# EasyEDA schematic SCH_protopanda_v10.json
TITLE: Protopanda; REV: 1.0; Date: 2025-01-20; Sheet: 1/1; Drawn By: mockthebear; Company: WAH
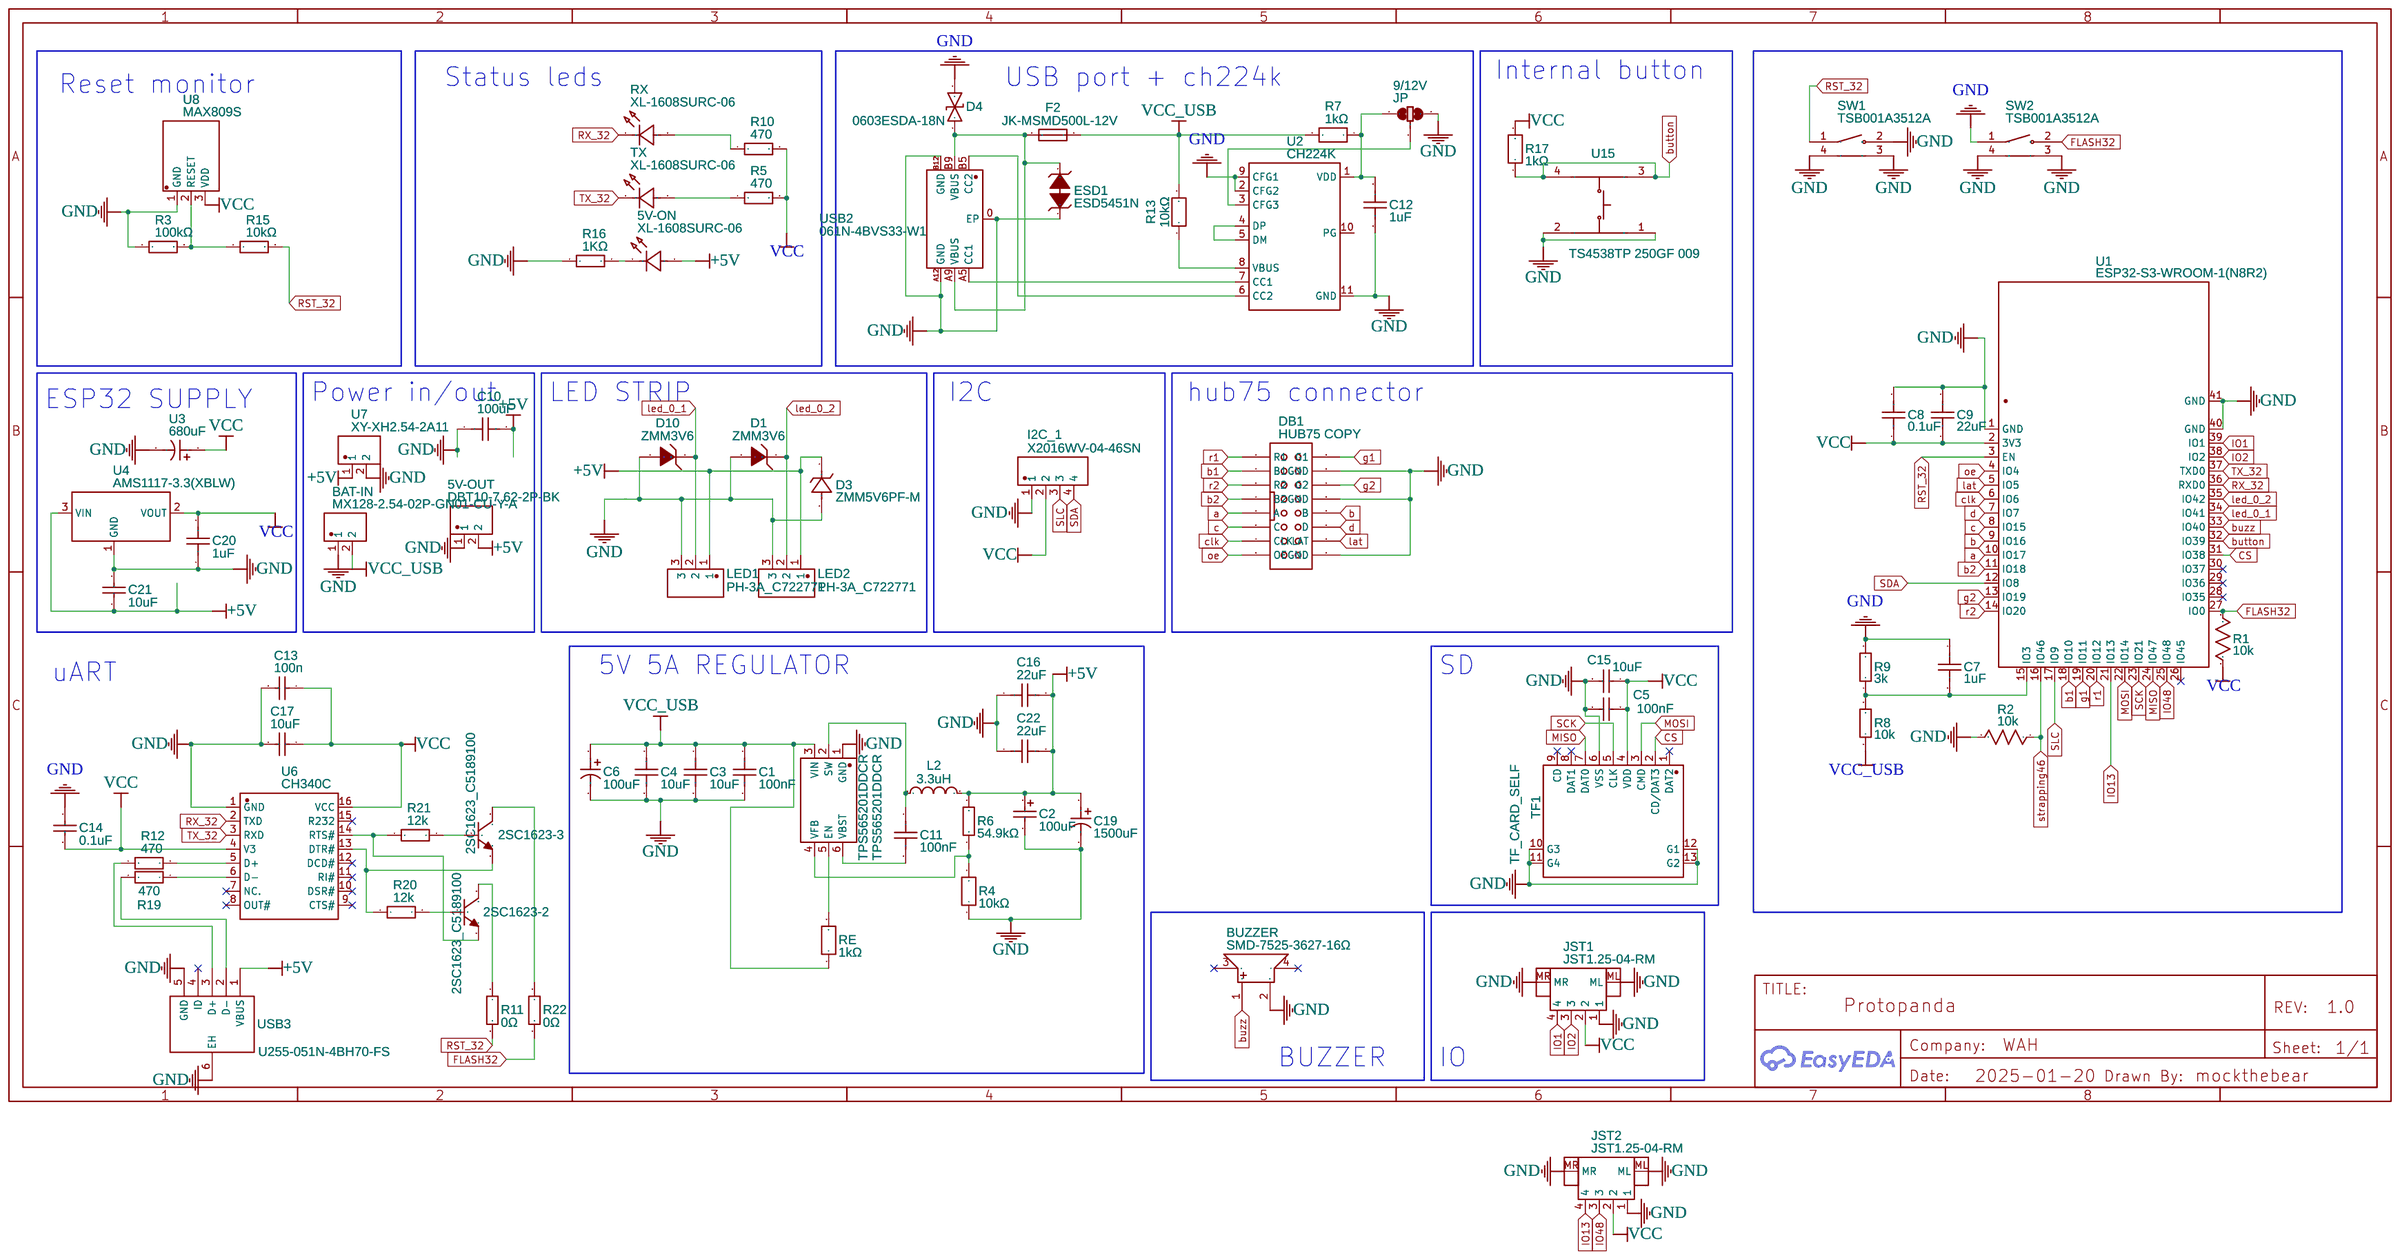
[diagram p0: schematic sheet]

## Parts
2SC1623-2  2SC1623_C5189100  [SOT-23-3_L2.9-W1.3-P1.90-LS2.4-BR]
2SC1623-3  2SC1623_C5189100  [SOT-23-3_L2.9-W1.3-P1.90-LS2.4-BR]
5V-ON  XL-1608SURC-06  [LED0603-RD_RED]
5V-OUT  DBT10-7.62-2P-BK  [CONN-TH_2P-P7.62_DBT10-7.62-2P-BK]
9/12V  JP  [PAD-JUMPER-3-NO_YES_SILK_FULL_BOX]
BAT-IN  MX128-2.54-02P-GN01-CU-Y-A  [CONN-TH_2P-P2.54_MX128-2.54-GN01-02P-CU-Y-A]
BUZZER  SMD-7525-3627-16Ω  [BUZ-SMD_4P-L7.5-W7.5-BR]
C1  100nF  [C0603]
C2  100uF  [CASE-A_3216]
C3  10uF  [C0603]
C4  10uF  [C0603]
C5  100nF  [C0603]
C6  100uF  [CAP-SMD_BD6.3-L6.6-W6.6-LS7.2-FD]
C7  1uF  [C0603]
C8  0.1uF  [C0603]
C9  22uF  [C0603]
C10  100uF  [C1206]
C11  100nF  [C0603]
C12  1uF  [C0603]
C13  100n  [C0603]
C14  0.1uF  [C0603]
C15  10uF  [C0603]
C16  22uF  [C0805]
C17  10uF  [C0603]
C19  1500uF  [CAP-SMD_BD8.0-L8.3-W8.3-LS9.3-FD-1]
C20  1uF  [C0603]
C21  10uF  [C0603]
C22  22uF  [C0805]
D1  ZMM3V6  [LL-34_L3.5-W1.5-RD]
D3  ZMM5V6PF-M  [LL-34_L3.5-W1.5-RD]
D4  0603ESDA-18N  [D0603-BI]
D10  ZMM3V6  [LL-34_L3.5-W1.5-RD]
DB1  HUB75 COPY  [HUB75]
ESD1  ESD5451N  [DFN1006-2L-BI]
F2  JK-MSMD500L-12V  [F1812]
I2C_1  X2016WV-04-46SN  [CONN-TH_X2016WV-04-46SN]
JST1  JST1.25-04-RM  [JST1.25-04-RM]
JST2  JST1.25-04-RM  [JST1.25-04-RM]
L2  3.3uH  [IND-SMD_L11.0-W10.0]
LED1  PH-3A_C722771  [CONN-TH_PH-3A]
LED2  PH-3A_C722771  [CONN-TH_PH-3A]
R1  10k  [R0603]
R2  10k  [R0603]
R3  100kΩ  [R0603]
R4  10kΩ  [R0603]
R5  470  [R0603]
R6  54.9kΩ  [R0603]
R7  1kΩ  [R0603]
R8  10k  [R0603]
R9  3k  [R0603]
R10  470  [R0603]
R11  0Ω  [R0603]
R12  470  [R0603]
R13  10kΩ  [R0603]
R15  10kΩ  [R0603]
R16  1KΩ  [R0603]
R17  1kΩ  [R0603]
R19  470  [R0603]
R20  12k  [R0603]
R21  12k  [R0603]
R22  0Ω  [R0603]
RE  1kΩ  [R0603]
RX  XL-1608SURC-06  [LED0603-RD_RED]
SW1  TSB001A3512A  [SW-SMD_TSB001XXXX]
SW2  TSB001A3512A  [SW-SMD_TSB001XXXX]
TF1  TF_CARD_SELF  [TF-SMD_TF-15-15]
TPS565201DDCR  TPS565201DDCR  [TSOT-23-6_L2.9-W1.6-P0.95-LS2.8-BL]
TX  XL-1608SURC-06  [LED0603-RD_RED]
U1  ESP32-S3-WROOM-1(N8R2)  [WIRELM-SMD_ESP32-S3-WROOM-1]
U2  CH224K  [ESSOP-10_L4.9-W3.9-P1.0-LS6.0-TL-EP]
U3  680uF  [CAP-SMD_BD6.3-L6.6-W6.6-LS7.4-FD]
U4  AMS1117-3.3(XBLW)  [SOT-89-3_L4.5-W2.5-P1.50-LS4.2-BR]
U6  CH340C  [SOP-16_L10.0-W3.9-P1.27-LS6.0-BL]
U7  XY-XH2.54-2A11  [HDR-TH_2P-P2.50-V-F-1]
U8  MAX809S  [SOT-23-3_L2.9-W1.3-P1.90-LS2.4-BR]
U15  TS4538TP 250GF 009  [SW-SMD_4P-L4.5-W4.5-P3.00-LS6.8]
USB2  061N-4BVS33-W1  [USB-C-SMD_061N-4BVS33-W1]
USB3  U255-051N-4BH70-FS  [MINI-USB-SMD_U255-051N-4BH70-XS]

## Library data of the parts
2SC1623-2 2SC1623-3 = 2SC1623_C5189100: Supplier: LCSC; Supplier Part: C5189100; Manufacturer: HXY MOSFET(华轩阳电子); Manufacturer Part: 2SC1623; link: https://atta.szlcsc.comnull; Contributor: lcsc
5V-ON RX TX = XL-1608SURC-06: Supplier: LCSC; Supplier Part: C965799; Manufacturer: XINGLIGHT(成兴光); JLCPCB Part Class: Extended Part; Contributor: LCSC
5V-OUT = DBT10-7.62-2P-BK: Supplier: LCSC; Supplier Part: C430662; Manufacturer: DIBO(地博电气); Manufacturer Part: DBT10-7.62-2P-BK-P; Contributor: LCSC; JLCPCB Part Class: Extended Part
9/12V = JUMPER-PAD-3-NOFULL_BOX_SILK: Contributor: SparkFun
BAT-IN = MX128-2.54-02P-GN01-CU-Y-A: Supplier: LCSC; Supplier Part: C5188442; Manufacturer: MAX(迈旭); Manufacturer Part: MX128-2.54-02P-GN01-Cu-Y-A; JLCPCB Part Class: Extended Part; Contributor: lcsc; link: https://lcsc.com/eda_search?q=C5188442&%26type=1&ref=editor
BUZZER = SMD-7525-3627-16Ω: Supplier: LCSC; Supplier Part: C2685546; Manufacturer: S&S(海旭); Contributor: LCSC; JLCPCB Part Class: Extended Part
C1 C3 C4 C11 C12 = CC0603CRNPO9BN5R1: Supplier: LCSC; Supplier Part: C519376; Manufacturer: YAGEO; Contributor: LCSC; JLCPCB Part Class: Extended Part
C2 = T490A107M006ATE800: Supplier: LCSC; Manufacturer: KEMET(基美); Supplier Part: C122251; JLCPCB Part Class: Extended Part
C5 = C0603X104K101T: Supplier: LCSC; Manufacturer: HEC; Supplier Part: C105907; JLCPCB Part Class: Extended Part
C6 = RVT100UF25V67RV0011: Supplier: LCSC; Supplier Part: C2836443; Manufacturer: KNSCHA(科尼盛); JLCPCB Part Class: Extended Part; Contributor: LCSC
C7 C20 = CS1608X7R105K250NRB: Supplier: LCSC; Supplier Part: C513775; Manufacturer: Samwha Capacitor; Contributor: LCSC; JLCPCB Part Class: Extended Part
C8 = 0603BB104K500NGT: Supplier: LCSC; Supplier Part: C2168571; Manufacturer: Knowles(楼氏); Contributor: LCSC; JLCPCB Part Class: Extended Part
C9 = GRM188R61A226ME15D: Supplier: LCSC; Manufacturer: muRata(村田); Supplier Part: C84419; JLCPCB Part Class: Extended Part
C10 = TCC1206X5R107M6R3HT: Supplier: LCSC; Supplier Part: C380356; Manufacturer: CCTC(三环); JLCPCB Part Class: Extended Part; Contributor: lcsc
C13 C14 C17 = CC0603KRX5R5BB106: Supplier: LCSC; Manufacturer: YAGEO; Supplier Part: C109455; JLCPCB Part Class: Extended Part
C15 C21 = CC0603MRX5R6BB106: Supplier: LCSC; Manufacturer: YAGEO; Supplier Part: C109453; JLCPCB Part Class: Extended Part
C16 C22 = C_0805_US: Contributor: LCEDA_Lib
C19 = 189RV0022: Supplier: LCSC; Supplier Part: C7471884; Manufacturer: KNSCHA(科尼盛); JLCPCB Part Class: Extended Part; Contributor: lcsc
D1 D10 = ZMM3V6: Supplier: LCSC; Manufacturer Part: ZMM3V6-M; Manufacturer: ST(先科); Supplier Part: C8057; JLCPCB Part Class: Extended Part
D3 = ZMM5V6PF-M: Supplier: LCSC; Supplier Part: C7497481; Manufacturer: ST(先科); JLCPCB Part Class: Extended Part; Contributor: lcsc
D4 = 0603ESDA-18N: Contributor: LCSC; Supplier: LCSC; Supplier Part: C316055; Manufacturer: BORN(伯恩半导体); JLCPCB Part Class: Extended Part
DB1 = HUB75 COPY: Contributor: japplegame
ESD1 = ESD5451N: Contributor: lcsc; Supplier: LCSC; Supplier Part: C2987696; Manufacturer: UMW(广东友台半导体); JLCPCB Part Class: Extended Part
F2 = JK-MSMD500L-12V: Contributor: LCSC; Supplier: LCSC; Supplier Part: C2844238; Manufacturer: JK(金科); JLCPCB Part Class: Extended Part
I2C_1 = X2016WV-04-46SN: Supplier: LCSC; Supplier Part: C696988; Manufacturer: XKB Connectivity(中国星坤); Contributor: LCSC; JLCPCB Part Class: Extended Part
JST1 JST2 = JST1.25-04-RM: Contributor: Александр Концевой
L2 = PSPMAA1040H-3R3M-ANP: Supplier: LCSC; Supplier Part: C436569; Manufacturer: PROD(谱罗德); Contributor: LCSC; JLCPCB Part Class: Extended Part
LED1 LED2 = PH-3A_C722771: Supplier: LCSC; Supplier Part: C722771; Manufacturer: CAX(创都); Manufacturer Part: PH-3A; Contributor: LCSC; JLCPCB Part Class: Extended Part
R1 R2 = R_0603_US: Contributor: LCEDA_Lib
R3 R15 = PTFR0603B10K0P9: Supplier: LCSC; Supplier Part: C328421; Manufacturer: ResistorToday; Resistance (Ohms): 10K; Contributor: LCSC; JLCPCB Part Class: Extended Part
R4 R7 R13 R17 RE = FRC0603F4992TS: Supplier: LCSC; Supplier Part: C2930109; Manufacturer: FOJAN(富捷); Contributor: lcsc; JLCPCB Part Class: Extended Part
R5 R8-R10 R12 R16 R19-R21 = CR0603FA56R0G: Supplier: LCSC; Manufacturer: LIZ; Supplier Part: C101115; Resistance (Ohms): 56; JLCPCB Part Class: Extended Part
R6 = RCT03365KFLF: Supplier: LCSC; Supplier Part: C178113; Manufacturer: Hong Kong Resistors; Resistance (Ohms): 365K; Contributor: LCSC; JLCPCB Part Class: Extended Part
R11 R22 = AECR0603F100RK9: Supplier: LCSC; Supplier Part: C328334; Manufacturer: ResistorToday; Resistance (Ohms): 100; Contributor: LCSC; JLCPCB Part Class: Extended Part
SW1 SW2 = TSB001A3512A: Supplier: LCSC; Supplier Part: C2888948; Manufacturer: BZCN(博众电气); Contributor: LCSC; JLCPCB Part Class: Extended Part
TF1 = TF_CARD_SELF: Supplier: LCSC; Supplier Part: C9900010414; Manufacturer: null; Contributor: LCSC; JLCPCB Part Class: Extended Part
TPS565201DDCR = TPS565201DDCR: Supplier: LCSC; Supplier Part: C327676; Manufacturer: TI(德州仪器); Contributor: LCSC; JLCPCB Part Class: Extended Part
U1 = ESP32-S3-WROOM-1(N8R2): Supplier: LCSC; Supplier Part: C2913204; Manufacturer: ESPRESSIF(乐鑫); Manufacturer Part: ESP32-S3-WROOM-1-N8R2; link: https://atta.szlcsc.com/upload/public/pdf/source/20220628/A2AC12B3C87735CAEB7EBE2DBE80936C.pdf; JLCPCB Part Class: Extended Part; Contributor: lcsc
U2 = CH224K: Supplier: LCSC; Supplier Part: C970725; Manufacturer: WCH(南京沁恒); link: https://atta.szlcsc.com/upload/public/pdf/source/20220425/5F3B4646B9AC793D88468BCB08421765.pdf; JLCPCB Part Class: Extended Part; Contributor: lcsc
U3 = 189RV0015: Supplier: LCSC; Supplier Part: C7471877; Manufacturer: KNSCHA(科尼盛); Contributor: lcsc; JLCPCB Part Class: Extended Part
U4 = AMS1117-3.3(XBLW): Supplier: LCSC; Supplier Part: C18723569; Manufacturer: XBLW(芯伯乐); Contributor: lcsc
U6 = CH340C: Supplier: LCSC; Manufacturer: WCH(南京沁恒); Supplier Part: C84681; JLCPCB Part Class: Extended Part
U7 = XY-XH2.54-2A11: Supplier: LCSC; Supplier Part: C19271368; Manufacturer: XYECONN(辛译); Contributor: lcsc; JLCPCB Part Class: Extended Part
U8 = MAX809S: Supplier: LCSC; Supplier Part: C347371; Manufacturer: UMW(广东友台半导体); Contributor: LCSC; JLCPCB Part Class: Extended Part
U15 = TS4538TP 250GF 009: Contributor: lcsc; Supplier: LCSC; Supplier Part: C5359325; Manufacturer: SHOU HAN(首韩); Manufacturer Part: TS4538TP 250gf 009
USB2 = 061N-4BVS33-W1: Contributor: lcsc; Supplier: LCSC; Supplier Part: C5440738; Manufacturer: HanElectricity(瀚源)
USB3 = U255-051N-4BH70-FS: Supplier: LCSC; Supplier Part: C437032; Manufacturer: XKB Enterprise; Contributor: LCSC; JLCPCB Part Class: Extended Part

## Nets
+5V: 5V-ON.2(A) 5V-OUT.2 C2.1 C10.2 C16.2 C19.1 C21.2 C22.2 D3.1(C) L2.2 LED1.1 LED2.1 R6.2 U4.3(VIN) U7.1 USB3.1(VBUS)
GND: 5V-OUT.1 9/12V.3 BAT-IN.1 BUZZER.2 C1.2 C2.2 C3.2 C4.2 C5.1 C6.2 C7.1 C8.2 C9.1 C10.1 C12.2 C13.2 C14.1 C15.2 C16.1 C17.2 C19.2 C20.1 C21.1 C22.1 D1.2(A) D3.2(A) D4.2 D10.2(A) DB1.9(GND) DB1.13(GND) DB1.15(GND) ESD1.1 I2C_1.1 JST1.1 JST1.ML JST1.MR JST2.1 JST2.ML JST2.MR LED1.3 LED2.3 R2.2 R3.1 R4.1 R9.2 R16.1 SW1.2 SW1.3 SW1.4 SW2.1 SW2.3 SW2.4 TF1.6(VSS) TF1.10(G3) TF1.11(G4) TF1.12(G1) TF1.13(G2) TPS565201DDCR.1(GND) U1.1(GND) U1.40(GND) U1.41(GND) U2.2(CFG2) U2.9(CFG1) U2.11(GND) U3.2 U4.1(GND) U6.1(GND) U7.2 U8.1(GND) U15.1 U15.2 USB2.0(EP) USB2.A12(GND) USB2.B12(GND) USB3.5(GND) USB3.6(EH)
VCC: C5.2 C8.1 C9.2 C13.1 C14.2 C15.1 C17.1 C20.2 I2C_1.2 JST1.2 JST2.2 R1.1 R5.2 R10.2 R17.2 TF1.4(VDD) U1.2(3V3) U3.1 U4.2(VOUT) U6.4(V3) U6.16(VCC) U8.3(VDD)
VCC_USB: BAT-IN.2 C1.1 C3.1 C4.1 C6.1 F2.1 R7.2 R8.1 R13.2 RE.1 TPS565201DDCR.3(VIN)
a: DB1.5(A) U1.10(IO17)
b: DB1.12(B) U1.9(IO16)
b1: DB1.2(B1) U1.18(IO10)
b2: DB1.4(B2) U1.11(IO18)
button: R17.1 U1.32(IO39) U15.3 U15.4
buzz: BUZZER.1 U1.33(IO40)
c: DB1.6(C) U1.8(IO15)
clk: DB1.7(CLK) U1.6(IO6)
CS: TF1.2(CD/DAT3) U1.31(IO38)
d: DB1.11(D) U1.7(IO7)
FLASH32: R1.2 R22.1 SW2.2 U1.27(IO0)
g1: DB1.16(G1) U1.19(IO11)
g2: DB1.14(G2) U1.13(IO19)
IO1: JST1.4 U1.39(IO1)
IO2: JST1.3 U1.38(IO2)
IO13: JST2.4 U1.21(IO13)
IO48: JST2.3 U1.25(IO48)
lat: DB1.10(LAT) U1.5(IO5)
led_0_1: D10.1(C) LED1.2 U1.34(IO41)
led_0_2: D1.1(C) LED2.2 U1.35(IO42)
MISO: TF1.7(DAT0) U1.24(IO47)
MOSI: TF1.3(CMD) U1.22(IO14)
oe: DB1.8(OE) U1.4(IO4)
r1: DB1.1(R1) U1.20(IO12)
r2: DB1.3(R2) U1.14(IO20)
RST_32: R11.2 R15.2 SW1.1 U1.3(EN)
RX_32: RX.1(K) U1.36(RXD0) U6.2(TXD)
SCK: TF1.5(CLK) U1.23(IO21)
SDA: I2C_1.4 U1.12(IO8)
SLC: I2C_1.3 U1.17(IO9)
strapping46: R2.1 U1.16(IO46)
TX_32: TX.1(K) U1.37(TXD0) U6.3(RXD)
Net-(9/12V-1): 9/12V.1 C12.1 R7.1 U2.1(VDD)
Net-(9/12V-2): 9/12V.2 U2.3(CFG3)
Net-(2SC1623-2-1): 2SC1623-2.1(B) R20.2
Net-(2SC1623-2-2): 2SC1623-2.2(E) R21.1 U6.14(RTS#)
Net-(2SC1623-2-3): 2SC1623-2.3(C) R11.1
Net-(2SC1623-3-1): 2SC1623-3.1(B) R21.2
Net-(2SC1623-3-2): 2SC1623-3.2(E) R20.1 U6.13(DTR#)
Net-(2SC1623-3-3): 2SC1623-3.3(C) R22.2
Net-(5V-ON-1): 5V-ON.1(K) R16.2
Net-(C7-2): C7.2 R8.2 R9.1 U1.15(IO3)
Net-(C11-1): C11.1 L2.1 TPS565201DDCR.2(SW)
Net-(C11-2): C11.2 TPS565201DDCR.6(VBST)
Net-(D4-1): D4.1 ESD1.2 F2.2 USB2.A9(VBUS) USB2.B9(VBUS)
Net-(R3-2): R3.2 R15.1 U8.2(RESET)
Net-(R4-2): R4.2 R6.1 TPS565201DDCR.4(VFB)
Net-(R5-1): R5.1 TX.2(A)
Net-(R10-1): R10.1 RX.2(A)
Net-(R12-1): R12.1 USB3.3(D+)
Net-(R12-2): R12.2 U6.5(D+)
Net-(R13-1): R13.1 U2.8(VBUS)
Net-(R19-1): R19.1 U6.6(D-)
Net-(R19-2): R19.2 USB3.2(D-)
Net-(RE-2): RE.2 TPS565201DDCR.5(EN)
Net-(U2-4): U2.4(DP) U2.5(DM)
Net-(U2-6): U2.6(CC2) USB2.B5(CC2)
Net-(U2-7): U2.7(CC1) USB2.A5(CC1)

Not connected (* = marked no-connect by the designer): BUZZER 3* 4*; TF1 1(DAT2)* 8(DAT1)* 9(CD)*; U1 26(IO45)* 28(IO35)* 29(IO36)* 30(IO37)*; U2 10(PG); U6 7(NC.)* 8(OUT#)* 9(CTS#)* 10(DSR#)* 11(RI#)* 12(DCD#)* 15(R232)*; USB3 4(ID)*

## Notes on the sheet
- Internal button
- Reset monitor
- Status leds
- USB port + ch224k
- ESP32 SUPPLY
- Power in/out
- LED STRIP
- I2C
- hub75 connector
- 5V 5A REGULATOR
- SD
- uART
- BUZZER
- IO
